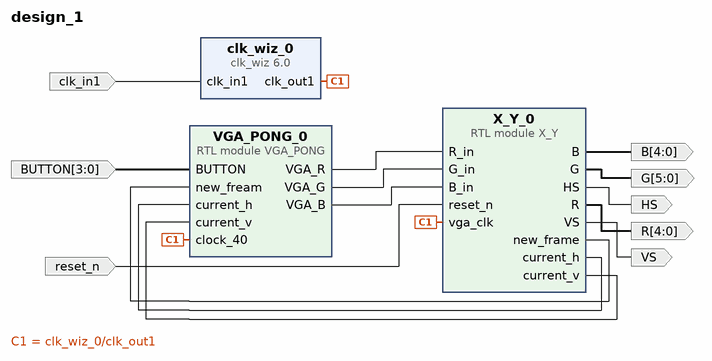
[diagram p0: block diagram of the top level]
# Vivado block design design_1, xc7z010clg400-1, Vivado 2018.2
create_bd_design design_1

create_bd_port -dir I -type clk clk_in1
set_property -dict {CONFIG.FREQ_HZ 125000000} [get_bd_ports clk_in1]
create_bd_port -dir O -from 4 -to 0 R
create_bd_port -dir O -from 5 -to 0 G
create_bd_port -dir O -from 4 -to 0 B
create_bd_port -dir I -from 3 -to 0 BUTTON
create_bd_port -dir O HS
create_bd_port -dir O VS
create_bd_port -dir I -type rst reset_n

create_bd_cell -type ip -vlnv xilinx.com:ip:clk_wiz:6.0 clk_wiz_0
set_property -dict [list \
  CONFIG.PRIM_IN_FREQ 125.000 \
  CONFIG.CLKIN1_JITTER_PS 80.0 \
  CONFIG.CLKOUT1_REQUESTED_OUT_FREQ 40.000 \
  CONFIG.MMCM_DIVCLK_DIVIDE 1 \
  CONFIG.MMCM_CLKFBOUT_MULT_F 8.000 \
  CONFIG.MMCM_CLKIN1_PERIOD 8.000 \
  CONFIG.MMCM_CLKOUT0_DIVIDE_F 25.000 \
  CONFIG.CLKOUT1_JITTER 150.675 \
  CONFIG.CLKOUT1_PHASE_ERROR 96.948 \
] [get_bd_cells clk_wiz_0]
create_bd_cell -type module -reference VGA_PONG VGA_PONG_0
create_bd_cell -type module -reference X_Y X_Y_0

# ---- connections ----

connect_bd_net -net clk_in1_1 [get_bd_ports clk_in1] [get_bd_pins clk_wiz_0/clk_in1]
connect_bd_net [get_bd_pins clk_wiz_0/clk_out1] [get_bd_pins VGA_PONG_0/clock_40] [get_bd_pins X_Y_0/vga_clk]
connect_bd_net [get_bd_pins VGA_PONG_0/VGA_R] [get_bd_pins X_Y_0/R_in]
connect_bd_net [get_bd_pins VGA_PONG_0/VGA_G] [get_bd_pins X_Y_0/G_in]
connect_bd_net [get_bd_pins VGA_PONG_0/VGA_B] [get_bd_pins X_Y_0/B_in]
connect_bd_net [get_bd_pins X_Y_0/R] [get_bd_ports R]
connect_bd_net [get_bd_pins X_Y_0/G] [get_bd_ports G]
connect_bd_net [get_bd_pins X_Y_0/B] [get_bd_ports B]
connect_bd_net [get_bd_ports BUTTON] [get_bd_pins VGA_PONG_0/BUTTON]
connect_bd_net [get_bd_pins X_Y_0/HS] [get_bd_ports HS]
connect_bd_net [get_bd_pins X_Y_0/VS] [get_bd_ports VS]
connect_bd_net [get_bd_ports reset_n] [get_bd_pins X_Y_0/reset_n]
connect_bd_net [get_bd_pins X_Y_0/new_frame] [get_bd_pins VGA_PONG_0/new_fream]
connect_bd_net [get_bd_pins X_Y_0/current_h] [get_bd_pins VGA_PONG_0/current_h]
connect_bd_net [get_bd_pins X_Y_0/current_v] [get_bd_pins VGA_PONG_0/current_v]

validate_bd_design
save_bd_design
